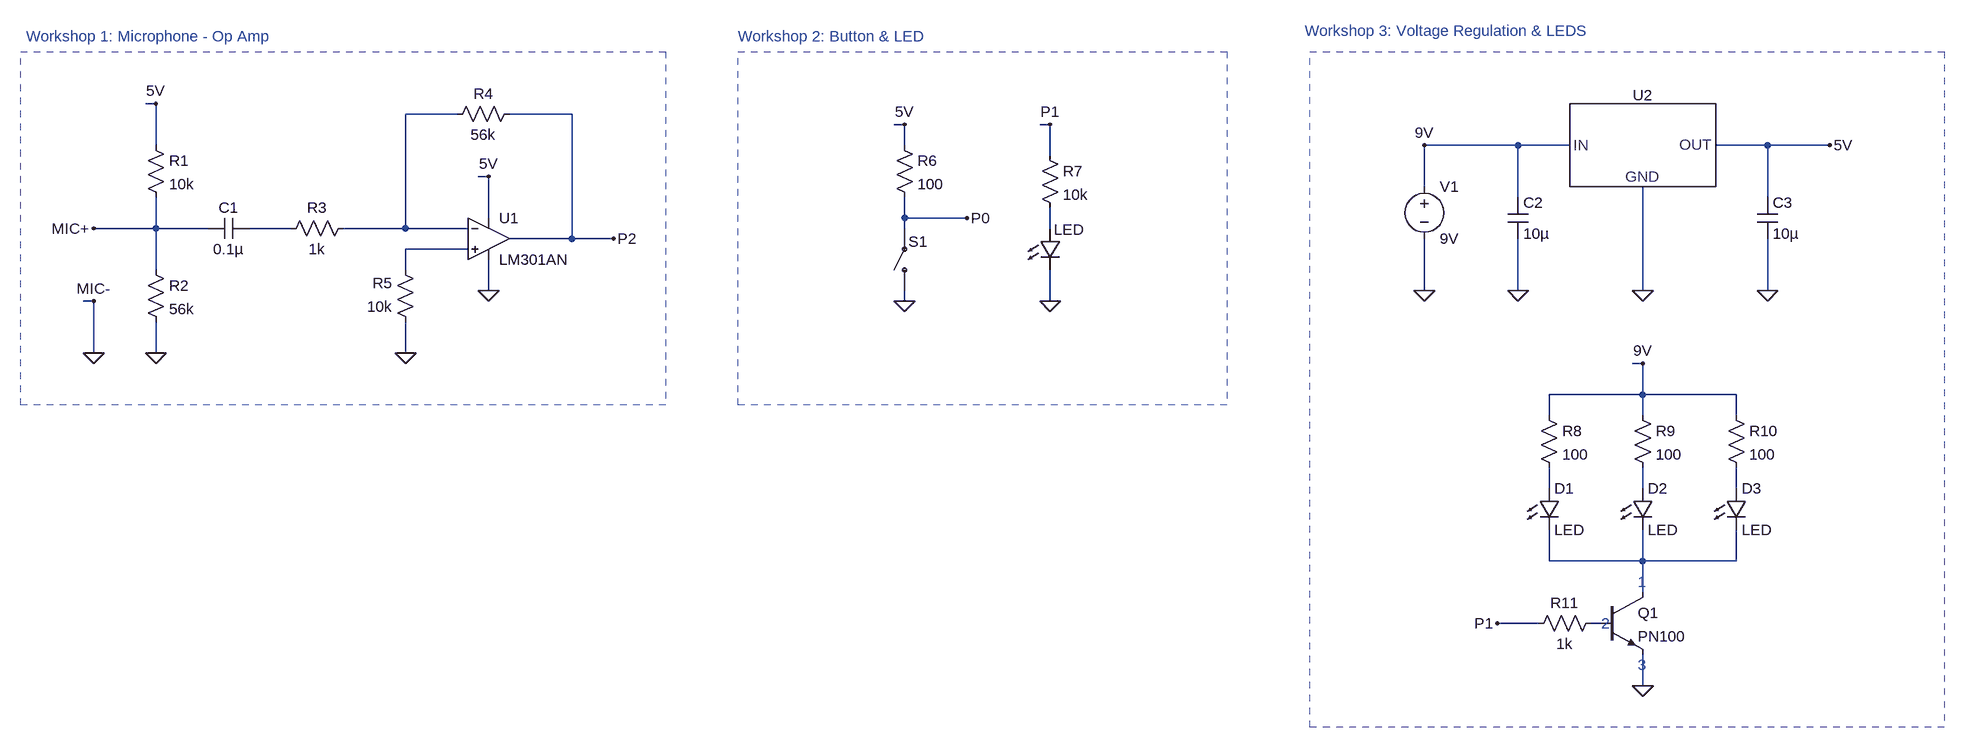
[diagram p0: schematic Clapper Project.asc]
Clapper Project.asc, the LTspice schematic file:
Version 4
SHEET 1 1252 1044
WIRE -1936 -912 -1952 -912
WIRE -1472 -896 -1552 -896
WIRE -1296 -896 -1392 -896
WIRE -784 -880 -800 -880
WIRE -560 -880 -576 -880
WIRE -1936 -848 -1936 -912
WIRE -784 -848 -784 -880
WIRE 160 -848 16 -848
WIRE 240 -848 160 -848
WIRE 544 -848 464 -848
WIRE 640 -848 544 -848
WIRE -560 -832 -560 -880
WIRE -1424 -800 -1440 -800
WIRE 16 -784 16 -848
WIRE 160 -768 160 -848
WIRE 544 -768 544 -848
WIRE -1424 -736 -1424 -800
WIRE -784 -736 -784 -768
WIRE -688 -736 -784 -736
WIRE -1936 -720 -1936 -768
WIRE -1936 -720 -2032 -720
WIRE -1856 -720 -1936 -720
WIRE -1728 -720 -1792 -720
WIRE -1552 -720 -1552 -896
WIRE -1552 -720 -1648 -720
WIRE -1456 -720 -1552 -720
WIRE -784 -720 -784 -736
WIRE -560 -720 -560 -752
WIRE -1296 -704 -1296 -896
WIRE -1296 -704 -1392 -704
WIRE -1232 -704 -1296 -704
WIRE -1456 -688 -1552 -688
WIRE -1936 -656 -1936 -720
WIRE -1552 -656 -1552 -688
WIRE -1424 -624 -1424 -672
WIRE 16 -624 16 -704
WIRE 160 -624 160 -704
WIRE 352 -624 352 -784
WIRE 544 -624 544 -704
WIRE -2032 -608 -2048 -608
WIRE -784 -608 -784 -624
WIRE -560 -608 -560 -656
WIRE -2032 -528 -2032 -608
WIRE -1936 -528 -1936 -576
WIRE -1552 -528 -1552 -576
WIRE 352 -512 336 -512
WIRE 352 -464 352 -512
WIRE 352 -464 208 -464
WIRE 496 -464 352 -464
WIRE 208 -432 208 -464
WIRE 352 -432 352 -464
WIRE 496 -432 496 -464
WIRE 208 -320 208 -352
WIRE 352 -320 352 -352
WIRE 496 -320 496 -352
WIRE 208 -208 208 -256
WIRE 352 -208 352 -256
WIRE 352 -208 208 -208
WIRE 496 -208 496 -256
WIRE 496 -208 352 -208
WIRE 352 -160 352 -208
WIRE 192 -112 128 -112
WIRE 288 -112 272 -112
WIRE 352 -16 352 -64
FLAG 16 -624 0
FLAG 160 -624 0
FLAG 544 -624 0
FLAG 640 -848 5V
FLAG 16 -848 9V
FLAG 352 -624 0
FLAG 352 -512 9V
FLAG 352 -16 0
FLAG 128 -112 P1
FLAG -784 -608 0
FLAG -560 -608 0
FLAG -560 -880 P1
FLAG -688 -736 P0
FLAG -784 -880 5V
FLAG -1936 -528 0
FLAG -1552 -528 0
FLAG -2032 -528 0
FLAG -2032 -720 MIC+
FLAG -2032 -608 MIC-
FLAG -1936 -912 5V
FLAG -1424 -624 0
FLAG -1232 -704 P2
FLAG -1424 -800 5V
SYMBOL cap 144 -768 R0
SYMATTR InstName C2
SYMATTR Value 10µ
SYMBOL cap 528 -768 R0
SYMATTR InstName C3
SYMATTR Value 10µ
SYMBOL voltage 16 -800 R0
WINDOW 123 0 0 Left 0
WINDOW 39 0 0 Left 0
SYMATTR InstName V1
SYMATTR Value 9V
SYMBOL TwoForty\\LM7805 352 -848 R0
SYMATTR InstName U2
SYMBOL LED 192 -320 R0
SYMATTR InstName D1
SYMATTR Value LED
SYMBOL LED 336 -320 R0
SYMATTR InstName D2
SYMATTR Value LED
SYMBOL LED 480 -320 R0
SYMATTR InstName D3
SYMATTR Value LED
SYMBOL res 192 -448 R0
SYMATTR InstName R8
SYMATTR Value 100
SYMBOL res 336 -448 R0
SYMATTR InstName R9
SYMATTR Value 100
SYMBOL res 480 -448 R0
SYMATTR InstName R10
SYMATTR Value 100
SYMBOL res 288 -128 R90
WINDOW 0 0 56 VBottom 2
WINDOW 3 32 56 VTop 2
SYMATTR InstName R11
SYMATTR Value 1k
SYMBOL npn 288 -160 R0
SYMATTR InstName Q1
SYMATTR Value PN100
SYMBOL switch -784 -672 M90
WINDOW 0 -28 35 VLeft 2
SYMATTR InstName S1
SYMBOL LED -576 -720 R0
WINDOW 0 24 0 Invisible 2
WINDOW 3 22 2 Left 2
SYMATTR InstName D4
SYMATTR Value LED
SYMBOL res -576 -848 R0
SYMATTR InstName R7
SYMATTR Value 10k
SYMBOL res -800 -864 R0
SYMATTR InstName R6
SYMATTR Value 100
SYMBOL res -1952 -864 R0
SYMATTR InstName R1
SYMATTR Value 10k
SYMBOL res -1952 -672 R0
SYMATTR InstName R2
SYMATTR Value 56k
SYMBOL res -1632 -736 R90
WINDOW 0 0 56 VBottom 2
WINDOW 3 32 56 VTop 2
SYMATTR InstName R3
SYMATTR Value 1k
SYMBOL res -1376 -912 R90
WINDOW 0 0 56 VBottom 2
WINDOW 3 32 56 VTop 2
SYMATTR InstName R4
SYMATTR Value 56k
SYMBOL res -1536 -560 R180
WINDOW 0 36 76 Left 2
WINDOW 3 36 40 Left 2
SYMATTR InstName R5
SYMATTR Value 10k
SYMBOL cap -1792 -736 R90
WINDOW 0 0 32 VBottom 2
WINDOW 3 32 32 VTop 2
SYMATTR InstName C1
SYMATTR Value 0.1µ
SYMBOL OpAmps\\opamp2 -1424 -768 R0
SYMATTR InstName U1
SYMATTR Value LM301AN
TEXT 344 -176 Left 2 ;1
TEXT 288 -112 Left 2 ;2
TEXT 344 -48 Left 2 ;3
TEXT -2136 -1016 Left 2 ;Workshop 1: Microphone - Op Amp
TEXT -1040 -1016 Left 2 ;Workshop 2: Button & LED
TEXT -168 -1024 Left 2 ;Workshop 3: Voltage Regulation & LEDS
RECTANGLE Normal -1152 -448 -2144 -992 2
RECTANGLE Normal 816 48 -160 -992 2
RECTANGLE Normal -288 -448 -1040 -992 2

The netlist it stands for:
* Clapper Project.asc
C2 9V 0 10µ
C3 5V 0 10µ
V1 9V 0 9V
XU2 9V 5V 0 LM7805  ; pins IN OUT GND
D1 N005 N008 LED
D2 N006 N008 LED
D3 N007 N008 LED
R8 9V N005 100
R9 9V N006 100
R10 9V N007 100
R11 N009 P1 1k
Q1 N008 N009 0 0 PN100
S1 P0 0 <InstName>
D4 N003 0 LED
R7 P1 N003 10k
R6 5V P0 100
R1 5V MIC+ 10k
R2 MIC+ 0 56k
R3 N001 N002 1k
R4 P2 N001 56k
R5 0 N004 10k
C1 N002 MIC+ 0.1µ
XU1 N004 N001 5V 0 P2 LM301AN  ; pins In+ In- V+ V- OUT
.model D D
.lib standard.dio
.model NPN NPN
.model PNP PNP
.lib standard.bjt
* 1
* 2
* 3
* Workshop 1: Microphone - Op Amp
* Workshop 2: Button & LED
* Workshop 3: Voltage Regulation & LEDS
.backanno
.end